# EAGLE design untitled (EAGLE 9.6.2)
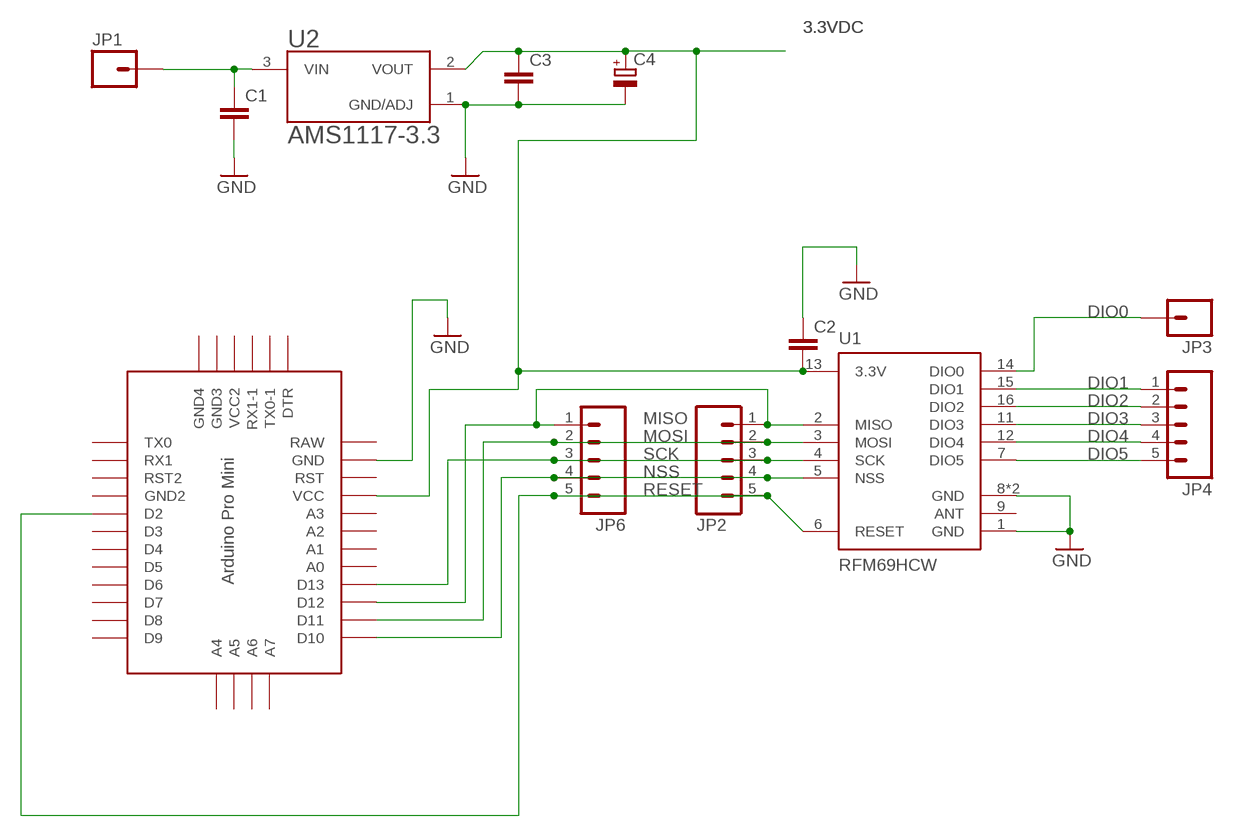
[diagram p0: schematic, sheet 1]

## Parts
C1  C-EU025-030X050  [C025-030X050]
C2  C-EU025-030X050  [C025-030X050]
C3  C-EU025-030X050  [C025-030X050]
C4  CPOL-EUE5-8.5  [E5-8,5]
JP1  M01SMDNS  [1X01NS]
JP2  M05_ROUNDONLY_NOSILK  [1X05_ROUNDONLY_NOSILK]
JP3  M01SMDNS  [1X01NS]
JP4  M05_ROUNDONLY_NOSILK  [1X05_ROUNDONLY_NOSILK]
JP6  M05_ROUNDONLY_NOSILK  [1X05_ROUNDONLY_NOSILK]
U1  RFM69HCW  [RFM69HCW-XXXS2]
U2  AMS1117-3.3  [SOT229P700X180-4N]
U$1  PRO-MINI  [PRO-MINI]

## Nets
3.3VDC: C2.2 C3.1 C4.+ U1.13(3.3V) U2.2(VOUT) U$1.VCC
DIO0: JP3.1 U1.14(DIO0)
DIO1: JP4.1 U1.15(DIO1)
DIO2: JP4.2 U1.16(DIO2)
DIO3: JP4.3 U1.11(DIO3)
DIO4: JP4.4 U1.12(DIO4)
DIO5: JP4.5 U1.7(DIO5)
GND: C1.2 C2.1 C3.2 C4.- U1.1(GND) U1.8(GND) U1.10(GND) U2.1(GND/ADJ) U$1.GND
MISO: JP2.1 JP6.1 U1.2(MISO) U$1.D12
MOSI: JP2.2 JP6.2 U1.3(MOSI) U$1.D11
N$6: C1.1 JP1.1 U2.3(VIN)
NSS: JP2.4 JP6.4 U1.5(NSS) U$1.D10
RESET: JP2.5 JP6.5 U1.6(RESET) U$1.D2
SCK: JP2.3 JP6.3 U1.4(SCK) U$1.D13
Unconnected: U1.9(ANT) U$1.A0 U$1.A1 U$1.A2 U$1.A3 U$1.A4 U$1.A5 U$1.A6 U$1.A7 U$1.D3 U$1.D4 U$1.D5 U$1.D6 U$1.D7 U$1.D8 U$1.D9 U$1.DTR U$1.GND1(GND2) U$1.GND2(GND4) U$1.GND3 U$1.RST U$1.RST1(RST2) U$1.RX1 U$1.RX1-1 U$1.TX0 U$1.TX0-1 U$1.VCC1(VCC2)

## Power pins joined to a net without a drawn wire
RAW: U$1.RAW

## Library data of the parts
C1-C3 = rcl:C-EU: CAPACITOR, European symbol; SPICEPREFIX: C
C4 = rcl:CPOL-EU: POLARIZED CAPACITOR, European symbol; SPICEPREFIX: C
JP1 JP3 = mike-temp:M01: Header 1 Standard 1-pin 0.1" header. Use with straight break away headers (SKU : PRT-00116), right angle break away headers (PRT-00553), swiss pins (PRT-00743), machine pins (PRT-00117), and female headers (PRT-00115).
JP2 JP4 JP6 = mike-temp:M05: Header 5 Standard 5-pin 0.1" header. Use with straight break away headers (SKU : PRT-00116), right angle break away headers (PRT-00553), swiss pins (PRT-00743), machine pins (PRT-00117), and female headers (PRT-00115). Molex polarized connector foot print use with SKU : PRT-08230 with associated crimp pins and housings.
U1 = mike-temp:RFM69H
U2 = AMS1117-3.3:AMS1117-3.3: Check availability <https://pricing.snapeda.com/parts/AMS1117-3.3/Advanced%20Monolithic%20Systems/view-part?ref=eda>; AVAILABILITY: In Stock; DESCRIPTION: Sot223/Pkg 1-Amp 3.3-Volt Low Drop Out Voltage Regulatator; MF: Advanced Monolithic Systems; MP: AMS1117-3.3; PACKAGE: SOT-223 Seeed Technology; PRICE: None; PURCHASE-URL: https://pricing.snapeda.com/search/part/AMS1117-3.3/?ref=eda
U$1 = Arduino-clone:PRO-MINI: Arduion Pro Mini Clone V1.0 www.betemcu.cu

## Board
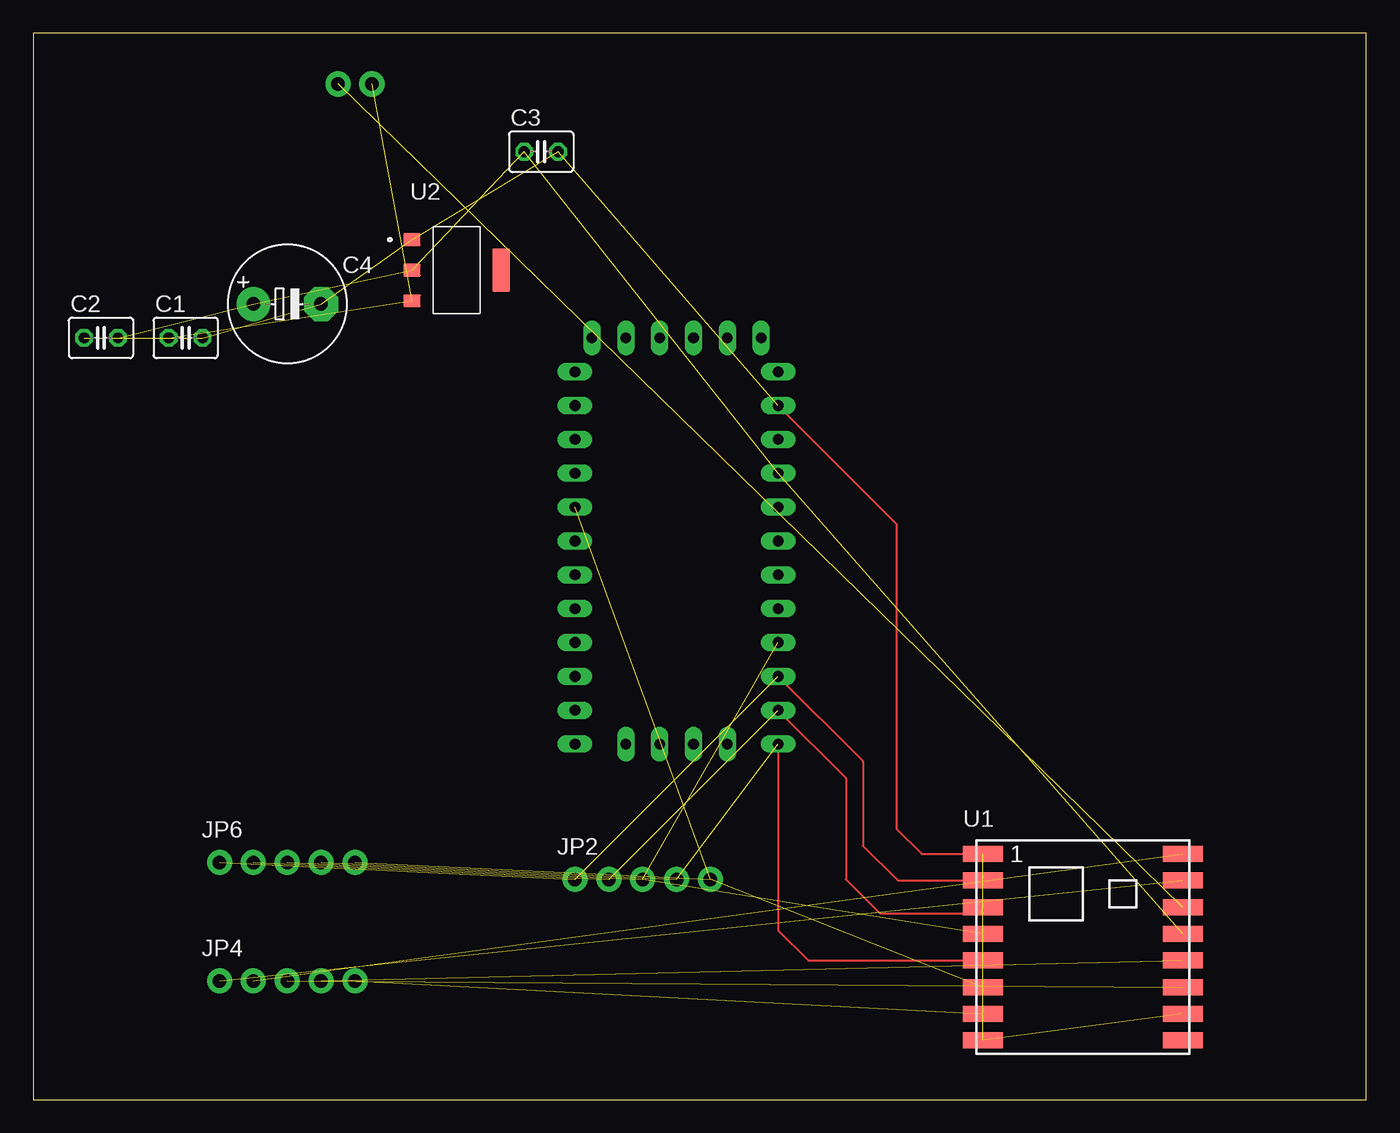
[diagram p1: board, top side]

Size 100 x 80 mm. Coordinates in mm from the lower left corner, seen from the top.
Outline: 0,0 100,0 100,80 0,80 0,0
Copper layers (1*16): Top 0.035mm / dielectric 1.5mm / Bottom 0.035mm
Design rules "default": minimum track width 6mil, minimum drill 0.35mm, track to track 6mil, track to pad 6mil, pad to pad 6mil, via to via 6mil, smd to smd 6mil, copper to edge 40mil, drill to drill 6mil, minimum pad ring 10mil, minimum via ring 8mil, stop-mask expansion 4mil, vias tented up to drill 0mil, thermal gap 10mil

### Footprints (pad centres in the part's own frame; a part is rotated, then mirrored left to right if it is on the bottom)
C025-030X050 = drill 0.813 octagon: 1 -1.27,0; 2 1.27,0
E5-8,5 = drill 1.016 pad 2.54: + -2.54,0 | drill 1.016 pad 2.54 octagon: - 2.54,0
1X01NS = drill 1.016 pad 1.88: 1 0,0
1X05_ROUNDONLY_NOSILK = drill 1.016 pad 1.88: 1 0,0; 2 2.54,0; 3 5.08,0; 4 7.62,0; 5 10.16,0
RFM69HCW-XXXS2 = smd 3 x 1.2: 1 -7.5,7; 2 -7.5,5; 3 -7.5,3; 4 -7.5,1; 5 -7.5,-1; 6 -7.5,-3; 7 -7.5,-5; 8 -7.5,-7; 9 7.5,-7; 10 7.5,-5; 11 7.5,-3; 12 7.5,-1; 13 7.5,1; 14 7.5,3; 15 7.5,5; 16 7.5,7
SOT229P700X180-4N = smd 1.31 x 0.93: 1 -3.345,2.29; 2 -3.345,0; 3 -3.345,-2.29 | smd 1.31 x 3.24: 4 3.345,0
PRO-MINI = drill 0.8 long: A0 8.89,8.89; A1 8.89,11.43; A2 8.89,13.97; A3 8.89,16.51; A4 -2.54,-1.27; A5 0,-1.27; A6 2.54,-1.27; A7 5.08,-1.27; D2 -6.35,16.51; D3 -6.35,13.97; D4 -6.35,11.43; D5 -6.35,8.89; D6 -6.35,6.35; D7 -6.35,3.81; D8 -6.35,1.27; D9 -6.35,-1.27; D10 8.89,-1.27; D11 8.89,1.27; D12 8.89,3.81; D13 8.89,6.35; DTR 7.62,29.21; GND 8.89,24.13; GND1 -6.35,19.05; GND2 -5.08,29.21; GND3 -2.54,29.21; RAW 8.89,26.67; RST 8.89,21.59; RST1 -6.35,21.59; RX1 -6.35,24.13; RX1-1 2.54,29.21; TX0 -6.35,26.67; TX0-1 5.08,29.21; VCC 8.89,19.05; VCC1 0,29.21

### Placement (x,y rotation side)
C1  11.43,57.15 0 top
C2  5.08,57.15 0 top
C3  38.1,71.12 0 top
C4  19.05,59.69 0 top
JP1  25.4,76.2 0 top
JP2  40.64,16.51 0 top
JP3  22.86,76.2 0 top
JP4  13.97,8.89 0 top
JP6  13.97,17.78 0 top
U1  78.74,11.43 0 top
U2  31.75,62.23 0 top
U$1  46.99,27.94 0 top

### Tracks (layer width: path | path; a pad name or v marks a point on that pad's centre or on a via)
3.3VDC  (5 unrouted)
DIO0  (1 unrouted)
DIO1  (1 unrouted)
DIO2  (1 unrouted)
DIO3  (1 unrouted)
DIO4  (1 unrouted)
DIO5  (1 unrouted)
GND  (7 unrouted)
  Top 0.152: U$1.GND 64.77,43.18 64.77,20.32 66.66,18.43 U1.1
MISO  (2 unrouted)
  Top 0.152: U$1.D12 62.23,25.4 62.23,19.05 64.85,16.43 U1.2
MOSI  (3 unrouted)
  Top 0.152: U$1.D11 60.96,24.13 60.96,16.51 63.5,13.97 71.12,13.97
N$6  (2 unrouted)
NSS  (2 unrouted)
  Top 0.152: U$1.D10 55.88,12.7 58.15,10.43 U1.5
RESET  (3 unrouted)
SCK  (3 unrouted)